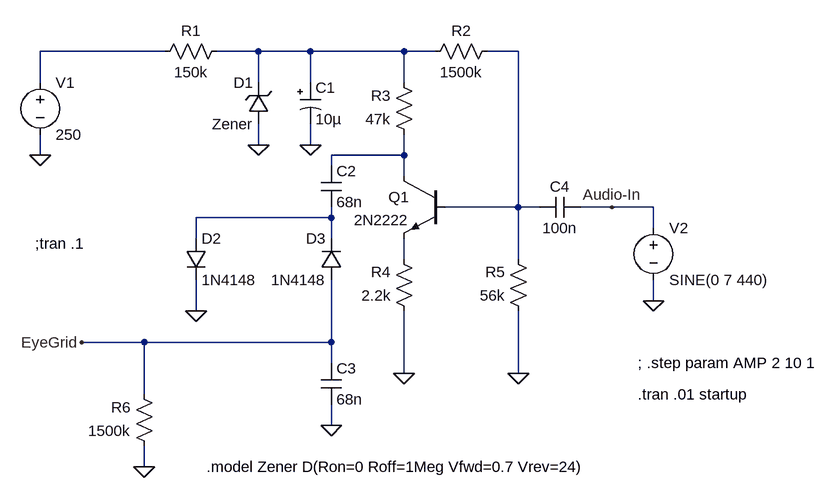
[diagram p0: schematic ForMagicEye-1.asc]
ForMagicEye-1.asc, the LTspice schematic file:
Version 4
SHEET 1 1252 920
WIRE 224 112 32 112
WIRE 368 112 304 112
WIRE 448 112 368 112
WIRE 592 112 448 112
WIRE 640 112 592 112
WIRE 768 112 720 112
WIRE 32 160 32 112
WIRE 368 160 368 112
WIRE 448 160 448 112
WIRE 592 160 592 112
WIRE 368 256 368 224
WIRE 448 256 448 224
WIRE 32 272 32 240
WIRE 592 272 592 240
WIRE 592 272 480 272
WIRE 480 288 480 272
WIRE 592 304 592 272
WIRE 768 352 768 112
WIRE 768 352 656 352
WIRE 800 352 768 352
WIRE 912 352 864 352
WIRE 976 352 912 352
WIRE 480 368 480 352
WIRE 480 368 272 368
WIRE 976 384 976 352
WIRE 272 400 272 368
WIRE 480 400 480 368
WIRE 592 432 592 400
WIRE 768 432 768 352
WIRE 976 496 976 464
WIRE 272 512 272 464
WIRE 192 560 96 560
WIRE 480 560 480 464
WIRE 480 560 192 560
WIRE 480 592 480 560
WIRE 592 608 592 512
WIRE 768 608 768 512
WIRE 192 640 192 560
WIRE 480 688 480 656
WIRE 192 752 192 720
FLAG 32 272 0
FLAG 192 752 0
FLAG 480 688 0
FLAG 592 608 0
FLAG 768 608 0
FLAG 448 256 0
FLAG 368 256 0
FLAG 912 352 Audio-In
FLAG 96 560 EyeGrid
FLAG 976 496 0
FLAG 272 512 0
SYMBOL voltage 32 144 R0
WINDOW 123 0 0 Left 0
WINDOW 39 0 0 Left 0
SYMATTR InstName V1
SYMATTR Value 250
SYMBOL res 320 96 R90
WINDOW 0 0 56 VBottom 2
WINDOW 3 32 56 VTop 2
SYMATTR InstName R1
SYMATTR Value 150k
SYMBOL res 736 96 R90
WINDOW 0 0 56 VBottom 2
WINDOW 3 32 56 VTop 2
SYMATTR InstName R2
SYMATTR Value 1500k
SYMBOL res 608 256 R180
WINDOW 0 36 76 Left 2
WINDOW 3 36 40 Left 2
SYMATTR InstName R3
SYMATTR Value 47k
SYMBOL res 608 528 R180
WINDOW 0 36 76 Left 2
WINDOW 3 36 40 Left 2
SYMATTR InstName R4
SYMATTR Value 2.2k
SYMBOL res 784 528 R180
WINDOW 0 36 76 Left 2
WINDOW 3 36 40 Left 2
SYMATTR InstName R5
SYMATTR Value 56k
SYMBOL res 208 736 R180
WINDOW 0 36 76 Left 2
WINDOW 3 36 40 Left 2
SYMATTR InstName R6
SYMATTR Value 1500k
SYMBOL zener 384 224 R180
WINDOW 0 24 64 Left 2
WINDOW 3 24 0 Left 2
SYMATTR InstName D1
SYMATTR Value Zener
SYMBOL polcap 432 160 R0
SYMATTR InstName C1
SYMATTR Value 10µ
SYMBOL npn 656 304 M0
SYMATTR InstName Q1
SYMATTR Value 2N2222
SYMBOL cap 464 288 R0
SYMATTR InstName C2
SYMATTR Value 68n
SYMBOL cap 464 592 R0
SYMATTR InstName C3
SYMATTR Value 68n
SYMBOL cap 864 336 R90
WINDOW 0 0 32 VBottom 2
WINDOW 3 32 32 VTop 2
SYMATTR InstName C4
SYMATTR Value 100n
SYMBOL diode 256 400 R0
SYMATTR InstName D2
SYMATTR Value 1N4148
SYMBOL diode 496 464 R180
WINDOW 0 24 64 Left 2
WINDOW 3 24 0 Left 2
SYMATTR InstName D3
SYMATTR Value 1N4148
SYMBOL voltage 976 368 R0
WINDOW 123 0 0 Left 0
WINDOW 39 0 0 Left 0
SYMATTR InstName V2
SYMATTR Value SINE(0 7 440)
TEXT 288 752 Left 2 !.model Zener D(Ron=0 Roff=1Meg Vfwd=0.7 Vrev=24)
TEXT 24 408 Left 2 !;tran .1
TEXT 952 592 Left 2 !; .step param AMP 2 10 1
TEXT 952 640 Left 2 !.tran .01 startup

The netlist it stands for:
* ForMagicEye-1.asc
V1 N001 0 250
R1 N002 N001 150k
R2 N003 N002 1500k
R3 N004 N002 47k
R4 0 N006 2.2k
R5 0 N003 56k
R6 0 EyeGrid 1500k
D1 0 N002 Zener
C1 N002 0 10µ
Q1 N004 N003 N006 0 2N2222
C2 N004 N005 68n
C3 EyeGrid 0 68n
C4 Audio-In N003 100n
D2 N005 0 1N4148
D3 EyeGrid N005 1N4148
V2 Audio-In 0 SINE(0 7 440)
.model D D
.lib standard.dio
.model NPN NPN
.model PNP PNP
.lib standard.bjt
.model Zener D(Ron=0 Roff=1Meg Vfwd=0.7 Vrev=24)
;tran .1
; .step param AMP 2 10 1
.tran .01 startup
.backanno
.end